# EAGLE schematic juki_shield (EAGLE 5.11)

## Sheet 1 of 2
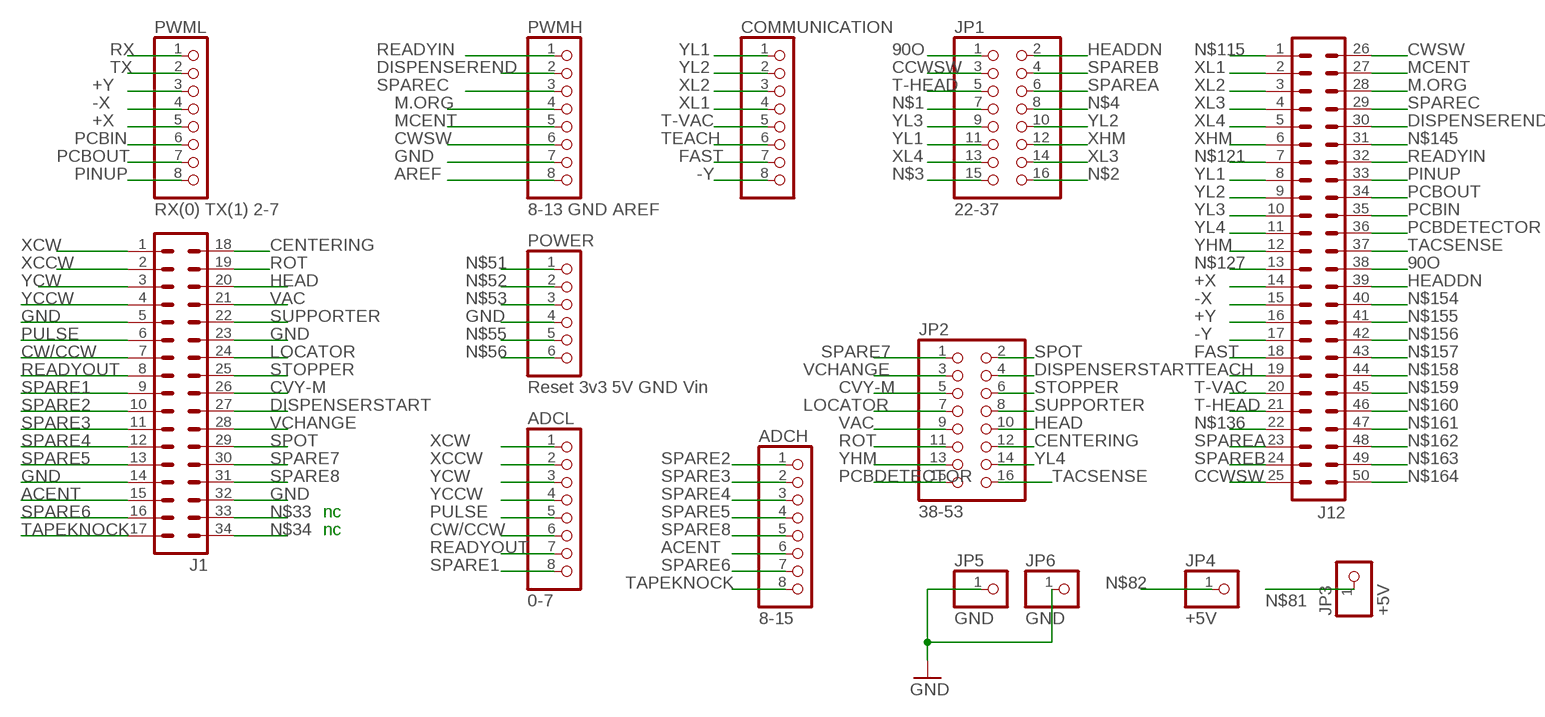
[diagram p0: schematic, sheet 1]

### Parts
ADCH  8-15  PINHD-1X8  [1X08]
ADCL  0-7  PINHD-1X8  [1X08]
COMMUNICATION  PINHD-1X8  [1X08]
J1  ML34  [ML34]
J12  ML50  [ML50]
JP1  22-37  PINHD-2X8  [2X08]
JP2  38-53  PINHD-2X8  [2X08]
JP3  +5V  PINHD-1X1  [1X01]
JP4  +5V  PINHD-1X1  [1X01]
JP5  GND  PINHD-1X1  [1X01]
JP6  GND  PINHD-1X1  [1X01]
POWER  Reset 3v3 5V GND Vin  PINHD-1X6  [1X06]
PWMH  8-13 GND AREF  PINHD-1X8  [1X08]
PWML  RX(0) TX(1) 2-7  PINHD-1X8  [1X08]

### Nets
90O: J12.38 JP1.1
+X: J12.14 PWML.5
+Y: J12.16 PWML.3
-X: J12.15 PWML.4
-Y: COMMUNICATION.8 J12.17
ACENT: ADCH.6 J1.15
AREF: PWMH.8
CCWSW: J12.25 JP1.3
CENTERING: J1.18 JP2.12
CVY-M: J1.26 JP2.5
CW/CCW: ADCL.6 J1.7
CWSW: J12.26 PWMH.6
DISPENSEREND: J12.30 PWMH.2
DISPENSERSTART: J1.27 JP2.4
FAST: COMMUNICATION.7 J12.18
GND: J1.5 J1.14 J1.23 J1.32 JP5.1 JP6.1 POWER.4 PWMH.7
HEAD: J1.20 JP2.10
HEADDN: J12.39 JP1.2
LOCATOR: J1.24 JP2.7
M.ORG: J12.28 PWMH.4
MCENT: J12.27 PWMH.5
N$1: JP1.7
N$2: JP1.16
N$3: JP1.15
N$4: JP1.8
N$33: J1.33
N$34: J1.34
N$51: POWER.1
N$52: POWER.2
N$53: POWER.3
N$55: POWER.5
N$56: POWER.6
N$81: JP3.1
N$82: JP4.1
N$115: J12.1
N$121: J12.7
N$127: J12.13
N$136: J12.22
N$145: J12.31
N$154: J12.40
N$155: J12.41
N$156: J12.42
N$157: J12.43
N$158: J12.44
N$159: J12.45
N$160: J12.46
N$161: J12.47
N$162: J12.48
N$163: J12.49
N$164: J12.50
PCBDETECTOR: J12.36 JP2.15
PCBIN: J12.35 PWML.6
PCBOUT: J12.34 PWML.7
PINUP: J12.33 PWML.8
PULSE: ADCL.5 J1.6
READYIN: J12.32 PWMH.1
READYOUT: ADCL.7 J1.8
ROT: J1.19 JP2.11
RX: PWML.1
SPARE1: ADCL.8 J1.9
SPARE2: ADCH.1 J1.10
SPARE3: ADCH.2 J1.11
SPARE4: ADCH.3 J1.12
SPARE5: ADCH.4 J1.13
SPARE6: ADCH.7 J1.16
SPARE7: J1.30 JP2.1
SPARE8: ADCH.5 J1.31
SPAREA: J12.23 JP1.6
SPAREB: J12.24 JP1.4
SPAREC: J12.29 PWMH.3
SPOT: J1.29 JP2.2
STOPPER: J1.25 JP2.6
SUPPORTER: J1.22 JP2.8
T-HEAD: J12.21 JP1.5
T-VAC: COMMUNICATION.5 J12.20
TACSENSE: J12.37 JP2.16
TAPEKNOCK: ADCH.8 J1.17
TEACH: COMMUNICATION.6 J12.19
TX: PWML.2
VAC: J1.21 JP2.9
VCHANGE: J1.28 JP2.3
XCCW: ADCL.2 J1.2
XCW: ADCL.1 J1.1
XHM: J12.6 JP1.12
XL1: COMMUNICATION.4 J12.2
XL2: COMMUNICATION.3 J12.3
XL3: J12.4 JP1.14
XL4: J12.5 JP1.13
YCCW: ADCL.4 J1.4
YCW: ADCL.3 J1.3
YHM: J12.12 JP2.13
YL1: COMMUNICATION.1 J12.8 JP1.11
YL2: COMMUNICATION.2 J12.9 JP1.10
YL3: J12.10 JP1.9
YL4: J12.11 JP2.14

### Notes on the sheet
- nc
- nc

## Sheet 2 of 2

## Library data of the parts
ADCH ADCL COMMUNICATION PWMH PWML = pinhead:PINHD-1X8: PIN HEADER
J1 = con-ml:ML34: HARTING; OC_FARNELL: unknown; OC_NEWARK: unknown
J12 = con-ml:ML50: HARTING; OC_FARNELL: unknown; OC_NEWARK: unknown
JP1 JP2 = pinhead:PINHD-2X8: PIN HEADER
JP3-JP6 = pinhead:PINHD-1X1: PIN HEADER
POWER = pinhead:PINHD-1X6: PIN HEADER

## Net classes
0 default: width 0.356 mm, drill 0.406 mm, clearance 0.203 mm
1 power: width 0.61 mm, drill 0.711 mm, clearance 0.203 mm
2 gnd: width 0.305 mm, drill 0.711 mm, clearance 0.203 mm
3 usbvcc: width 0.508 mm, drill 0.711 mm, clearance 0.203 mm